# Altium schematic sheet Main.SchDoc: μC & Power Delivery
size A4; Description: Atmega 1284p based Dev board with peripherals; Author: Lázár Sándor; Revision: 1; SheetNumber: 1; SheetTotal: 2; URL: lzrsystems.com; CreationDate: 06.07.2025
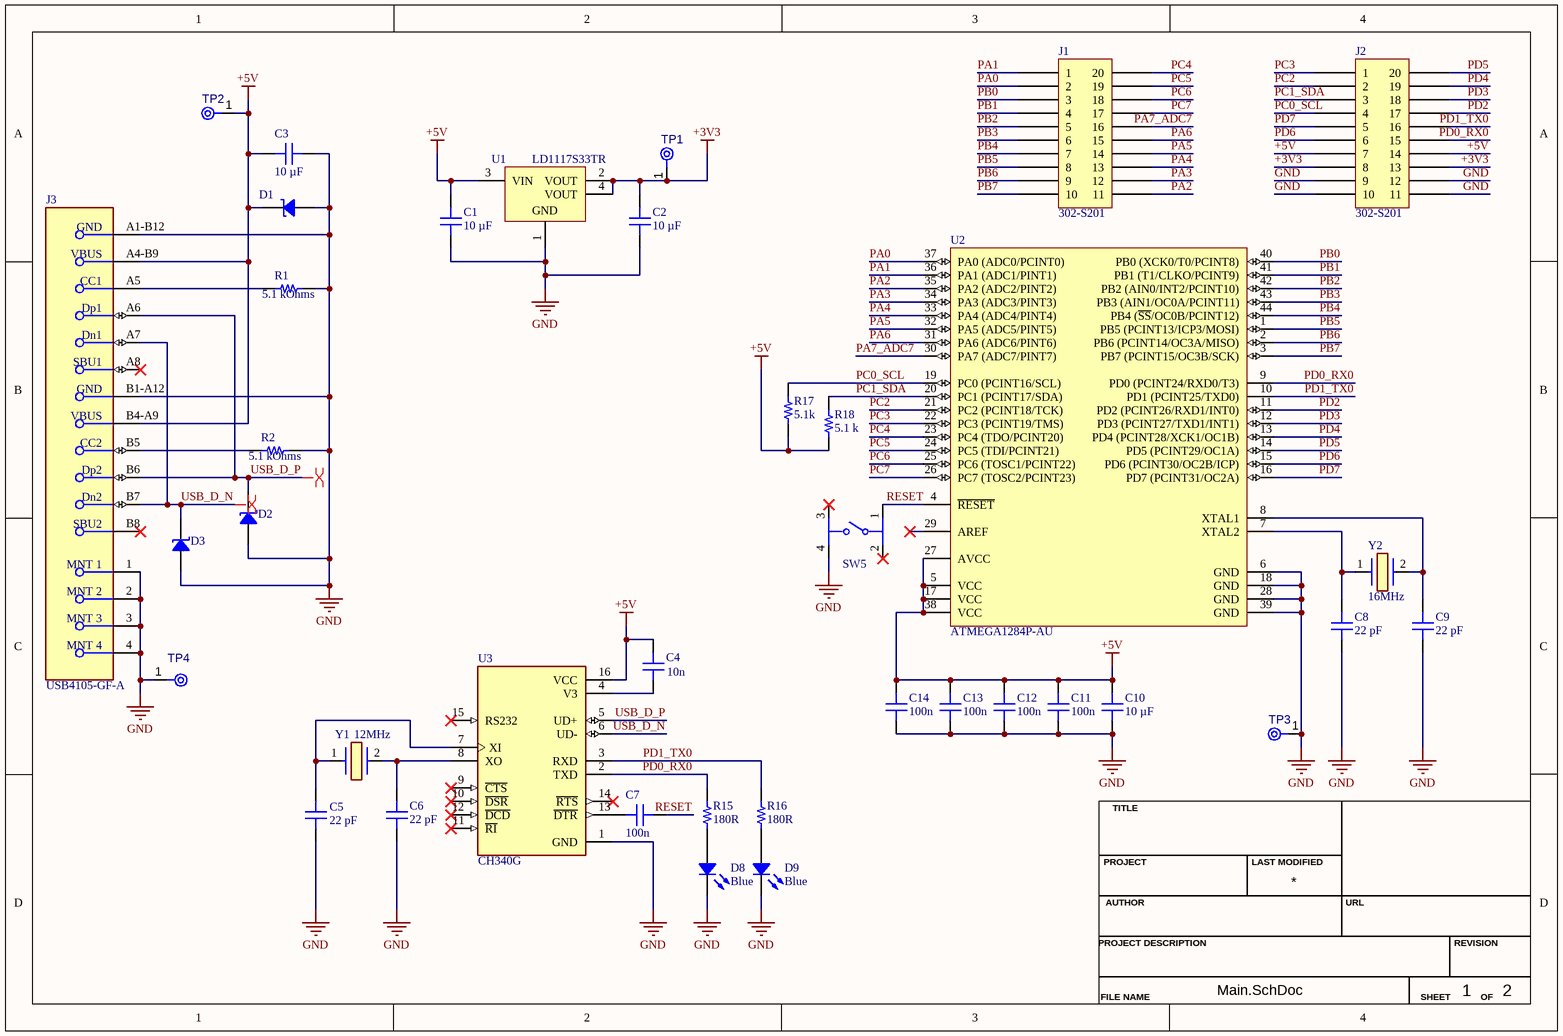
[diagram p0: Main.SchDoc]

## Parts
C1  10 µF  [CAP 1206_3216 - 0.8MM]
C2  10 µF  [CAP 1206_3216 - 0.8MM]
C3  10 µF  [CAP 1206_3216 - 0.8MM]
C4  Capacitance: 10n  [CAP 0805_2012]  (hidden comment: 10000 pF)
C5  22 pF  [CAP 0805_2012]
C6  22 pF  [CAP 0805_2012]
C7  Capacitance: 100n  [CAP 0805_2012]  (hidden comment: 0.1 µF)
C8  22 pF  [CAP 0805_2012]
C9  22 pF  [CAP 0805_2012]
C10  10 µF  [CAP 1206_3216 - 0.8MM]
C11  Capacitance: 100n  [CAP 0805_2012]  (hidden comment: 0.1 µF)
C12  Capacitance: 100n  [CAP 0805_2012]  (hidden comment: 0.1 µF)
C13  Capacitance: 100n  [CAP 0805_2012]  (hidden comment: 0.1 µF)
C14  Capacitance: 100n  [CAP 0805_2012]  (hidden comment: 0.1 µF)
D1  PESD5V0S1UB,115  [SOD523F]  (value not drawn)
D2  PESD5V0S1UB,115  [SOD523F]  (value not drawn)
D3  PESD5V0S1UB,115  [SOD523F]  (value not drawn)
D8  Blue  [LED 1206_3216 BLUE]
D9  Blue  [LED 1206_3216 BLUE]
J1  302-S201  [OST 302-S201]
J2  302-S201  [OST 302-S201]
J3  USB4105-GF-A  [FP-USB4105-GF-A-MFG]
R1  5.1 kOhms  [RES 0805_2012]
R2  5.1 kOhms  [RES 0805_2012]
R15  180R  [RES 0805_2012]
R16  180R  [RES 0805_2012]
R17  5.1k  [RES 0805_2012]
R18  5.1 k  [RES 0805_2012]
SW5  PTS526SK15SMTR2LFS  [FP-PTS526SK15SMTR2LFS-MFG]  (value not drawn)
TP1  TPAD6R  [TP06R]  (value not drawn)  (no BOM)
TP2  TPAD6R  [TP06R]  (value not drawn)  (no BOM)
TP3  TPAD6R  [TP06R]  (value not drawn)  (no BOM)
TP4  TPAD6R  [TP06R]  (value not drawn)  (no BOM)
U1  LD1117S33TR  [STM-SOT-223_M]
U2  ATMEGA1284P-AU  [ATML-44A_M]
U3  CH340G  [SOIC127P600X180-16N]
Y1  12MHz  [ECS160184XCKM]
Y2  16MHz  [ECS160184XCKM]

## Nets
+3V3: C2.2 J2.8 J2.13 TP1.1(TP) U1.2(VOUT) U1.4(VOUT)
+5V: C1.2 C3.1 C4.2 C10.2 C11.2 C12.2 C13.1 C14.2 D1.2 J2.7 J2.14 J3.A4-B9(VBUS) J3.B4-A9(VBUS) R17.1 R18.1 TP2.1(TP) U1.3(VIN) U2.5(VCC) U2.17(VCC) U2.27(AVCC) U2.38(VCC) U3.16(VCC)
GND: C1.1 C2.1 C3.2 C5.1 C6.1 C8.1 C9.1 C10.1 C11.1 C12.1 C13.2 C14.1 D1.1 D2.1 D3.1 D8.2 D9.2 J2.9 J2.10 J2.11 J2.12 J3.1(MNT_1) J3.2(MNT_2) J3.3(MNT_3) J3.4(MNT_4) J3.A1-B12(GND) J3.B1-A12(GND) R1.2 R2.2 SW5.4 TP3.1(TP) TP4.1(TP) U1.1(GND) U2.6(GND) U2.18(GND) U2.28(GND) U2.39(GND) U3.1(GND)
PA0: J1.2 U2.37(PA0_(ADC0/PCINT0))
PA1: J1.1 U2.36(PA1_(ADC1/PINT1))
PA2: J1.11 U2.35(PA2_(ADC2/PINT2))
PA3: J1.12 U2.34(PA3_(ADC3/PINT3))
PA4: J1.13 U2.33(PA4_(ADC4/PINT4))
PA5: J1.14 U2.32(PA5_(ADC5/PINT5))
PA6: J1.15 U2.31(PA6_(ADC6/PINT6))
PA7_ADC7: J1.16 U2.30(PA7_(ADC7/PINT7))
PB0: J1.3 U2.40(PB0_(XCK0/T0/PCINT8))
PB1: J1.4 U2.41(PB1_(T1/CLKO/PCINT9))
PB2: J1.5 U2.42(PB2_(AIN0/INT2/PCINT10))
PB3: J1.6 U2.43(PB3_(AIN1/OC0A/PCINT11))
PB4: J1.7 U2.44(PB4_(~{SS}/OC0B/PCINT12))
PB5: J1.8 U2.1(PB5_(PCINT13/ICP3/MOSI))
PB6: J1.9 U2.2(PB6_(PCINT14/OC3A/MISO))
PB7: J1.10 U2.3(PB7_(PCINT15/OC3B/SCK))
PC0_SCL: J2.4 R17.2 U2.19(PC0_(PCINT16/SCL))
PC1_SDA: J2.3 R18.2 U2.20(PC1_(PCINT17/SDA))
PC2: J2.2 U2.21(PC2_(PCINT18/TCK))
PC3: J2.1 U2.22(PC3_(PCINT19/TMS))
PC4: J1.20 U2.23(PC4_(TDO/PCINT20))
PC5: J1.19 U2.24(PC5_(TDI/PCINT21))
PC6: J1.18 U2.25(PC6_(TOSC1/PCINT22))
PC7: J1.17 U2.26(PC7_(TOSC2/PCINT23))
PD0_RX0: J2.15 R15.2 U2.9(PD0_(PCINT24/RXD0/T3)) U3.2(TXD)
PD1_TX0: J2.16 R16.2 U2.10(PD1_(PCINT25/TXD0)) U3.3(RXD)
PD2: J2.17 U2.11(PD2_(PCINT26/RXD1/INT0))
PD3: J2.18 U2.12(PD3_(PCINT27/TXD1/INT1))
PD4: J2.19 U2.13(PD4_(PCINT28/XCK1/OC1B))
PD5: J2.20 U2.14(PD5_(PCINT29/OC1A))
PD6: J2.6 U2.15(PD6_(PCINT30/OC2B/ICP))
PD7: J2.5 U2.16(PD7_(PCINT31/OC2A))
RESET: C7.2 SW5.1 U2.4(~{RESET})
USB_D_N: D3.2 J3.A7(Dn1) J3.B7(Dn2) U3.6(UD-)
USB_D_P: D2.2 J3.A6(Dp1) J3.B6(Dp2) U3.5(UD+)
NetC4_1: C4.1 U3.4(V3)
NetC5_2: C5.2 U3.7(XI) Y1.1
NetC6_2: C6.2 U3.8(XO) Y1.2(CRYSTAL_2)
NetC7_1: C7.1 U3.13(~{DTR})
NetC8_2: C8.2 U2.7(XTAL2) Y2.1
NetC9_2: C9.2 U2.8(XTAL1) Y2.2(CRYSTAL_2)
NetD8_1: D8.1 R15.1
NetD9_1: D9.1 R16.1
NetJ3_A5: J3.A5(CC1) R1.1
NetJ3_B5: J3.B5(CC2) R2.1

Not connected (* = marked no-connect by the designer): J3 A8(SBU1)* B8(SBU2)*; SW5 2* 3*; U2 29(AREF)*; U3 9(~{CTS})* 10(~{DSR})* 11(~{RI})* 12(~{DCD})* 14(~{RTS})* 15(RS232)*

## Layout directives
differential pair: USB_D_N, USB_D_P

## Notes on the sheet
- TITLE
- AUTHOR
- PROJECT
- LAST MODIFIED
- URL
- PROJECT DESCRIPTION
- REVISION
- FILE NAME
- SHEET
- OF

## Library data of the parts
C1-C3 C10 = GRT31CR6YA106KE01K: CAP CER 10UF 35V X5R 1206; manufacturer: Murata Electronics; Tolerance: ±10%; Part Number: GRT31CR6YA106KE01K; Capacitance: 10 µF; Applications: Automotive; componentlink1description: Datasheet; componentlink1url: https://search.murata.co.jp/Ceramy/image/img/A01X/G101/ENG/GRT31CR6YA106KE01-01.pdf; componentlink2description: DigiKey Link; componentlink2url: https://www.digikey.com/en/products/detail/murata-electronics/GRT31CR6YA106KE01K/13904946; Device Package: 1206 (3216 Metric); lastupdated: 6/4/2024 7:10:16 PM; Lifecycle Status: Active; Minimum Order: 1; Mounting Type: Surface Mount, MLCC; Operating Temperature: -55°C ~ 85°C; Package / Case: 1206 (3216 Metric); packaging: TapeAndReel; partid: 30257; Part Status: Active; price: 0.08; Ratings: AEC-Q200; series: GRT; Size / Dimension: 0.126" L x 0.063" W (3.20mm x 1.60mm); Supplier 1: DigiKey; Supplier Part Number 1: 490-GRT31CR6YA106KE01KCT-ND; Temperature Coefficient: X5R; Thickness (Max): 0.071" (1.80mm); value: 10 µF; Voltage - Rated: 35V
C4 = C0805X103K1RAC3316: CAP CER 0805 10NF 100V X7R; manufacturer: KEMET; Tolerance: ±10%; Part Number: C0805X103K1RAC3316; Applications: Automotive, Boardflex Sensitive; componentlink1description: Datasheet; componentlink1url: https://api.kemet.com/component-edge/download/datasheet/C0805X103K1RAC3316.pdf; componentlink2description: DigiKey Link; componentlink2url: https://www.digikey.com/en/products/detail/kemet/C0805X103K1RAC3316/10315780; Device Package: 0805 (2012 Metric); Features: Soft Termination; lastupdated: 2/9/2024 8:16:09 PM; Lifecycle Status: Active; Minimum Order: 1; Mounting Type: Surface Mount, MLCC; Operating Temperature: -55°C ~ 125°C; Package / Case: 0805 (2012 Metric); packaging: TapeAndReel; partid: 2565; Part Status: Active; price: 0.02; Ratings: AEC-Q200; series: SMD Auto X7R VW80808; Size / Dimension: 0.079" L x 0.049" W (2.00mm x 1.25mm); Supplier 1: DigiKey; Supplier Part Number 1: 399-C0805X103K1RAC3316CT-ND; Temperature Coefficient: X7R; Thickness (Max): 0.039" (0.98mm); value: 10000 pF; Voltage - Rated: 100V
C5 C6 C8 C9 = C0805C220J5GACAUTO: CAP CER 22PF 50V C0G/NP0 0805; manufacturer: KEMET; Temperature Coefficient: C0G, NP0; Tolerance: ±5%; Part Number: C0805C220J5GACAUTO; Capacitance: 22 pF; Applications: Automotive; componentlink1description: Datasheet; componentlink1url: https://api.kemet.com/component-edge/download/datasheet/C0805C220J5GACAUTO.pdf; componentlink2description: DigiKey Link; componentlink2url: https://www.digikey.com/en/products/detail/kemet/C0805C220J5GACAUTO/3314930; Device Package: 0805 (2012 Metric); Features: Low ESL; lastupdated: 2/9/2024 8:16:09 PM; Lifecycle Status: Active; Minimum Order: 1; Mounting Type: Surface Mount, MLCC; Operating Temperature: -55°C ~ 125°C; Package / Case: 0805 (2012 Metric); packaging: TapeAndReel; partid: 2537; Part Status: Active; price: 0.01; Ratings: AEC-Q200; series: SMD Auto C0G; Size / Dimension: 0.079" L x 0.049" W (2.00mm x 1.25mm); Supplier 1: DigiKey; Supplier Part Number 1: 399-6937-1-ND; Thickness (Max): 0.035" (0.88mm); value: 22 pF; Voltage - Rated: 50V
C7 C11-C14 = CC0805MRX7R9BB104: CAP CER 0.1UF 50V X7R 0805; manufacturer: Yageo; Tolerance: ±20%; Part Number: CC0805MRX7R9BB104; Applications: General Purpose; componentlink1description: Datasheet; componentlink1url: https://www.yageo.com/upload/media/product/productsearch/datasheet/mlcc/UPY-GPHC_X7R_6.3V-to-50V_18.pdf; componentlink2description: DigiKey Link; componentlink2url: https://www.digikey.com/en/products/detail/yageo/CC0805MRX7R9BB104/5884281; Device Package: 0805 (2012 Metric); lastupdated: 2/9/2024 8:16:09 PM; Lifecycle Status: Active; Minimum Order: 1; Mounting Type: Surface Mount, MLCC; Operating Temperature: -55°C ~ 125°C; Package / Case: 0805 (2012 Metric); packaging: TapeAndReel; partid: 2475; Part Status: Active; price: 0.01; series: CC; Size / Dimension: 0.079" L x 0.049" W (2.00mm x 1.25mm); Supplier 1: DigiKey; Supplier Part Number 1: 311-4351-1-ND; Temperature Coefficient: X7R; Thickness (Max): 0.037" (0.95mm); value: 0.1 µF; Voltage - Rated: 50V
D1-D3 = PESD5V0S1UB,115: TVS DIODE 5VWM 20VC SOD523; Manufacturer: Nexperia USA Inc.; Capacitance @ Frequency: 152pF @ 1MHz; Current - Peak Pulse (10/1000µs): 15A (8/20µs); Power Line Protection: No; Power - Peak Pulse: 260W; Type: Zener; Unidirectional Channels: 1; Voltage - Breakdown (Min): 6.4V; Voltage - Clamping (Max) @ Ipp: 20V; Voltage - Reverse Standoff (Typ): 5V (Max); Part Number: PESD5V0S1UB,115; Applications: General Purpose; ComponentLink1Description: Datasheet; ComponentLink1URL: https://assets.nexperia.com/documents/data-sheet/PESDXS1UB_SERIES.pdf; ComponentLink2Description: DigiKey Link; ComponentLink2URL: https://www.digikey.com/en/products/detail/nexperia-usa-inc/PESD5V0S1UB-115/1157466; LastUpdated: 6/3/2024 8:22:18 PM; Lifecycle Status: Active; Minimum Order: 1; Mounting Type: Surface Mount; Operating Temperature: -65°C ~ 150°C (TA); Package / Case: SC-79, SOD-523; Packaging: TapeAndReel; PartId: 9746; Part Status: Active; Price: 0.07; Series: -; Supplier 1: DigiKey; Supplier Part Number 1: 1727-3839-1-ND; Supplier Device Package: SOD-523
D8 D9 = SML-LX1206USBC-TR: LED BLUE CLEAR 1206 SMD; Manufacturer: Lumex Opto/Components Inc.; Configuration: Standard; Current - Test: 20mA; Lens Color: Colorless; Lens Size: 2.00mm x 1.50mm; Lens Style: Rectangle with Flat Top; Millicandela Rating: 25mcd; Viewing Angle: 140°; Voltage - Forward (Vf) (Typ): 3.5V; Wavelength - Peak: 470nm; Part Number: SML-LX1206USBC-TR; Color: Blue; ComponentLink1Description: Datasheet; ComponentLink1URL: https://www.lumex.com/content/files/ProductAttachment/SML-LX1206USBC-TR.pdf; ComponentLink2Description: DigiKey Link; ComponentLink2URL: https://www.digikey.com/en/products/detail/lumex-opto-components-inc/SML-LX1206USBC-TR/467547; Device Package: 1206 (3216 Metric); Height (Max): 1.10mm; LastUpdated: 6/3/2024 7:58:07 PM; Lens Transparency: Clear; Lifecycle Status: Active; Minimum Order: 1; Mounting Type: Surface Mount; Package / Case: 1206 (3216 Metric); Packaging: TapeAndReel; PartId: 732; Part Status: Active; Price: 0.58; Series: -; Size / Dimension: 3.20mm L x 1.60mm W; Supplier 1: DigiKey; Supplier Part Number 1: 67-1701-1-ND; Supplier Device Package: 1206; Value: Blue
J1 J2 = 302-S201: CONN HEADER VERT 20POS 2.54MM; Manufacturer: On Shore Technology Inc.; Contact Length - Post: 0.122" (3.10mm); Current Rating (Amps): 3A; Material Flammability Rating: UL94 V-0; Number of Positions: 20; Number of Positions Loaded: All; Pitch - Mating: 0.100" (2.54mm); Shrouding: Shrouded - 4 Wall; Style: Board to Cable/Wire; Part Number: 302-S201; ComponentLink1Description: Datasheet; ComponentLink1URL: http://www.on-shore.com/wp-content/uploads/2018/04/302-SXX1.pdf; ComponentLink2Description: DigiKey Link; ComponentLink2URL: https://www.digikey.com/en/products/detail/on-shore-technology-inc/302-S201/2794235; Connector Type: Header; Contact Finish - Mating: Gold; Contact Finish - Post: Gold; Contact Finish Thickness - Mating: Flash; Contact Material: Brass; Contact Shape: Square; Contact Type: Male Pin; Fastening Type: Push-Pull; Features: Keying Slot; Insulation Color: Black; Insulation Height: 0.358" (9.10mm); Insulation Material: Polyester, Glass Filled; LastUpdated: 8/14/2022 5:03:46 PM; Lifecycle Status: Active; Minimum Order: 1; Mounting Type: Through Hole; Number of Rows: 2; Operating Temperature: -40°C ~ 105°C; Packaging: Tray; PartId: 155; Part Status: Active; Price: 0.19; Row Spacing - Mating: 0.100" (2.54mm); Series: 302; Supplier 1: DigiKey; Supplier Part Number 1: ED10524-ND; Termination: Solder
J3 = CMP-002-00071-1: Conn USB 2.0 Type C RCP 24 POS 0.3mm/0.5mm Solder RA SMD 24 Terminal 1 Port T/R
R1 R2 = RMCF0805FT5K10: RES 5.1K OHM 1% 1/8W 0805; Manufacturer: Stackpole Electronics Inc; Power (Watts): 0.125W, 1/8W; Temperature Coefficient: ±100ppm/°C; Part Number: RMCF0805FT5K10; Value: 5.1 kOhms; ComponentLink1Description: Datasheet; ComponentLink1URL: https://www.seielect.com/catalog/sei-rmcf_rmcp.pdf; ComponentLink2Description: DigiKey Link; ComponentLink2URL: https://www.digikey.com/en/products/detail/stackpole-electronics-inc/RMCF0805FT5K10/1760394; Composition: Thick Film; Device Package: 0805 (2012 Metric); Features: Automotive AEC-Q200; Height - Seated (Max): 0.026" (0.65mm); LastUpdated: 2/8/2024 9:02:18 PM; Lifecycle Status: Active; Minimum Order: 1; Number of Terminations: 2; Operating Temperature: -55°C ~ 155°C; Package / Case: 0805 (2012 Metric); Packaging: CutTape; PartId: 32512; Part Status: Active; Price: 0.01; Ratings: AEC-Q200; Resistance: 5.1 kOhms; Series: RMCF; Size / Dimension: 0.079" L x 0.049" W (2.00mm x 1.25mm); Supplier 1: DigiKey; Supplier Part Number 1: RMCF0805FT5K10CT-ND; Supplier Device Package: 0805; Tolerance: ±1%
R15 R16 = CRCW0805180RFKEAHP: RES SMD 180 OHM 1% 1/2W 0805; Manufacturer: Vishay Dale; Power (Watts): 0.5W, 1/2W; Resistance: 180 Ohms; Temperature Coefficient: ±100ppm/°C; Part Number: CRCW0805180RFKEAHP; Value: 180R; ComponentLink1Description: Datasheet; ComponentLink1URL: http://www.vishay.com/docs/20043/crcwhpe3.pdf; ComponentLink2Description: DigiKey Link; ComponentLink2URL: https://www.digikey.com/en/products/detail/vishay-dale/CRCW0805180RFKEAHP/2226882; Composition: Thick Film; Device Package: 0805 (2012 Metric); Features: Automotive AEC-Q200, Pulse Withstanding; Height - Seated (Max): 0.020" (0.50mm); LastUpdated: 2/8/2024 9:02:28 PM; Lifecycle Status: Active; Minimum Order: 1; Number of Terminations: 2; Operating Temperature: -55°C ~ 155°C; Package / Case: 0805 (2012 Metric); Packaging: TapeAndReel; PartId: 30363; Part Status: Active; Price: 0.02; Ratings: AEC-Q200; Series: CRCW-HP; Size / Dimension: 0.079" L x 0.049" W (2.00mm x 1.25mm); Supplier 1: DigiKey; Supplier Part Number 1: 541-180TCT-ND; Supplier Device Package: 0805; Tolerance: ±1%
R17 R18 = RMCF0805FT5K10: RES 5.1K OHM 1% 1/8W 0805; Manufacturer: Stackpole Electronics Inc; Power (Watts): 0.125W, 1/8W; Resistance: 5.1 kOhms; Temperature Coefficient: ±100ppm/°C; Part Number: RMCF0805FT5K10; ComponentLink1Description: Datasheet; ComponentLink1URL: https://www.seielect.com/catalog/sei-rmcf_rmcp.pdf; ComponentLink2Description: DigiKey Link; ComponentLink2URL: https://www.digikey.com/en/products/detail/stackpole-electronics-inc/RMCF0805FT5K10/1760394; Composition: Thick Film; Device Package: 0805 (2012 Metric); Features: Automotive AEC-Q200; Height - Seated (Max): 0.026" (0.65mm); LastUpdated: 2/8/2024 9:02:18 PM; Lifecycle Status: Active; Minimum Order: 1; Number of Terminations: 2; Operating Temperature: -55°C ~ 155°C; Package / Case: 0805 (2012 Metric); Packaging: CutTape; PartId: 32512; Part Status: Active; Price: 0.01; Ratings: AEC-Q200; Series: RMCF; Size / Dimension: 0.079" L x 0.049" W (2.00mm x 1.25mm); Supplier 1: DigiKey; Supplier Part Number 1: RMCF0805FT5K10CT-ND; Supplier Device Package: 0805; Tolerance: ±1%
  R17: Value: 5.1k
  R18: Value: 5.1 k
SW5 = CMP-011-00013-1: Switch Tactile N.O. SPST Round Button Gull Wing 0.05A 12VDC 200000Cycles 2.45N SMD T/R
TP1-TP4 = CMP-00028-00002-2: 0.6mm round; Pins: 1
U1 = CMP-019-00019-3: Low Drop Positive Voltage Regulator, 800 mA, Fixed 3.3 V Output, 0 to 125 degC, 3-Pin TO-220, RoHS, Tape and Reel; Manufacturer: STMicroelectronics; Max Supply Voltage: 15V; Dropout Voltage: 1.1V; Power: 12W; Output Current: 950mA; Min Input Voltage: 4.75V; Nominal Output Voltage: 3.3V; Max Ouput Current: 1.3A; Outputs: 1; Packaging: TapeandReel; Datasheet Version: Rev. 33, 11/2013; RoHS Compliant: True; Mounting Technology: SM; Max Input Voltage: 15V; Max Operating Temperature: 125°C; Package Reference: SOT-223; Package Quantity: 2500; Package Description: 4-Pin Small Outline Transistor, Body 6.5 x 3.5 mm, Pitch 2.3 mm; Case/Package: TO-261-4; Min Operating Temperature: 0°C; Datasheet URL: http://www.farnell.com/datasheets/1776449.pdf; Min Supply Voltage: 4.75V; Pins: 3; Output Voltage: 3.3V; Manufacturer URL: http://www.st.com/
U2 = CMP-020-00002-3: 8-Bit Microcontroller with 128 KBytes In-System Programmable Flash, 32 I/Os, -40 to 85 degC, 44-Pin TQFP (44A), RoHS, Tray; Manufacturer: Atmel; Density: 128KB; Frequency: 20MHz; RAM Size: 16KB; PWM Channels: 6; USB Channels: 0; I/Os: 32; Min Supply Voltage: 1.8V; Max Supply Voltage: 5.5V; Interface: USART; ADC Channels: 8; Pins: 8; Manufacturer URL: http://www.atmel.com/; Case/Package: TQFP; Max Operating Temperature: 85°C; Package Description: 44-Pin Quad Flat Package, Body 10 x 10 mm, Pitch 0.8 mm; Mounting Technology: SM; Package Reference: 44A; Min Operating Temperature: -40°C; Clock Frequency: 20MHz; Datasheet Version: Rev. 8272G, 01/2015; Package Quantity: 160; Ethernet Channels: 0; Packaging: Tray; Datasheet URL: http://www.atmel.com/images/atmel-8272-8-bit-avr-microcontroller-atmega164a_pa-324a_pa-644a_pa-1284_p_summary.pdf; Max Clock Frequency: 20MHz; RoHS Compliant: True
U3 = CMP-003-000000-1: USB Interface Integrated Circuit; MF: WCH; Package: None; Source: CH340G.SchLib; Value: *; Availability: Not in stock; Price: None; Component Type: Standard; Design Item ID: CH340G; Check_prices: https://www.snapeda.com/parts/Ch340G/WCH/view-part/?ref=eda; SnapEDA_Link: https://www.snapeda.com/parts/Ch340G/WCH/view-part/?ref=snap; MP: Ch340G; Pin Count: 16
Y1 Y2 = ECS-160-18-4X-CKM: Crystal or Oscillator; Manufacturer_Name: ECS; Datasheet Link: https://www.mouser.be/datasheet/2/122/hc-49usx-791.pdf; Height: 3.5mm; Manufacturer_Part_Number: ECS-160-18-4X-CKM; Mouser Part Number: 520-ECS160-18-4X-CKM; Mouser Price/Stock: https://www.mouser.co.uk/ProductDetail/ECS/ECS-160-18-4X-CKM?qs=7MVldsJ5UawYqyimirccKw%3D%3D; Arrow Part Number: ECS-160-18-4X-CKM; Arrow Price/Stock: https://www.arrow.com/en/products/ecs-160-18-4x-ckm/ecs-international?region=nac